# Altium project Phone Charger.PrjPcb
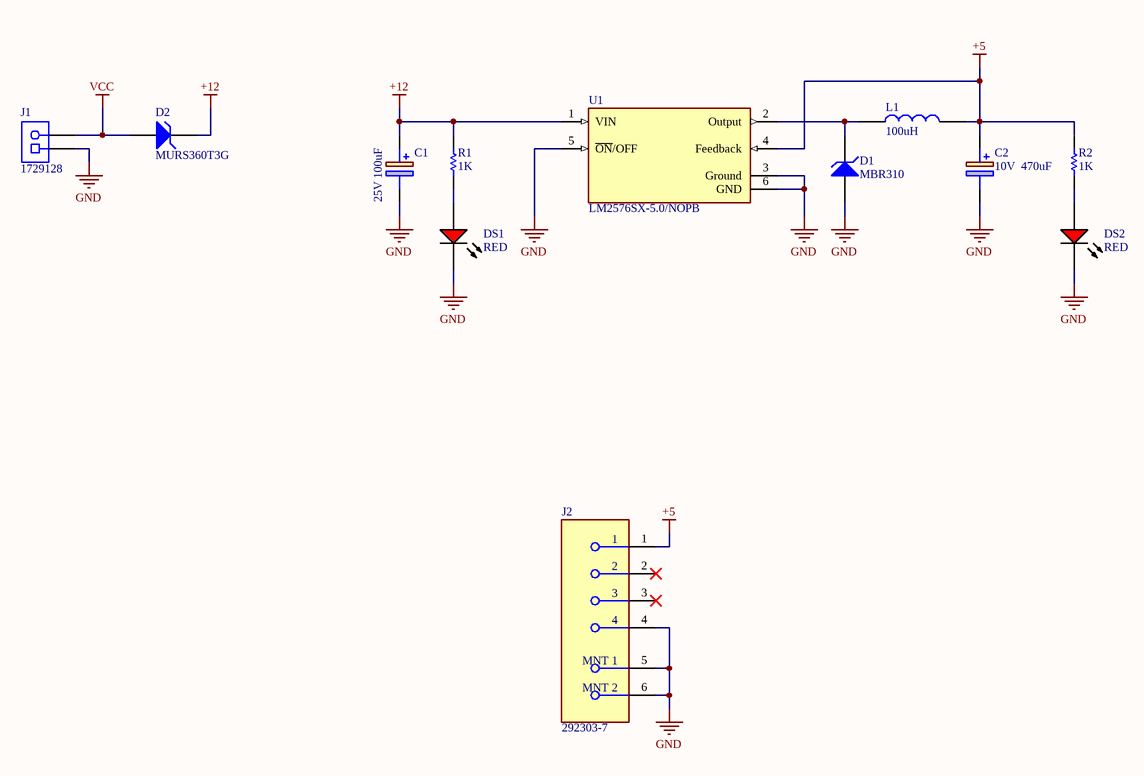
[diagram p0: Sheet1.SchDoc]
1 sheet, 12 parts. Net scope: global (net labels, ports and power ports of the same name join across sheets).
Board file: PCB1.PcbDoc

## Sheet Sheet1.SchDoc
size A4; SheetNumber: 1; SheetTotal: 1

### Parts
C1  25V 100uF  [EEHZA1E101XP]
C2  10V  470uF  [EEHZA1E101XP]
D1  MBR310  [LFUS-DO-214AB-2_V]
D2  MURS360T3G  [LFUS-DO-214AB-2_V]
DS1  RED  [LUMX-SML-LX1206IC_V]
DS2  RED  [LUMX-SML-LX1206IC_V]
J1  1729128  [PHOE-1729128-2_V]
J2  292303-7  [FP-292303-7-MFG]
L1  100uH  [SRR1260101M]
R1  1K  [RESC3216X70X50NL05T20]
R2  1K  [RESC3216X70X50NL05T20]
U1  LM2576SX-5.0/NOPB  [FP-KTT0005B-MFG]

### Nets
+5: C2.1(+) J2.1 L1.2 R2.2 U1.4(Feedback)
+12: C1.1(+) D2.2(K) R1.2 U1.1(VIN)
GND: C1.2(-) C2.2(-) D1.1(A) DS1.2(K) DS2.2(K) J1.1 J2.4 J2.5(MNT_1) J2.6(MNT_2) U1.3(Ground) U1.5(~{ON}/OFF) U1.6(GND)
VCC: D2.1(A) J1.2
NetD1_2: D1.2(K) L1.1 U1.2(Output)
NetDS1_1: DS1.1(A) R1.1
NetDS2_1: DS2.1(A) R2.1

Not connected (* = marked no-connect by the designer): J2 2* 3*

### Library data of the parts
C1 = EEH-ZA1E101XP: BXJ25VC100MF80TP; Manufacturer_Name: Panasonic; Geometry.Height: 8.3mm; Manufacturer_Part_Number: EEH-ZA1E101XP; Mouser Part Number: 667-EEH-ZA1E101XP; Mouser Price/Stock: https://www.mouser.co.uk/ProductDetail/Panasonic/EEH-ZA1E101XP?qs=7UCyOFMWVHbBL6OBgRrCPQ%3D%3D; Arrow Part Number: *; Arrow Price/Stock: *; Datasheet Link: http://industrial.panasonic.com/cdbs/www-data/pdf/RDD0000/ABA0000C1221.pdf
C2 = EEH-ZA1E101XP: EEE-FTA471XAP; Manufacturer_Name: Panasonic; Geometry.Height: 8.3mm; Manufacturer_Part_Number: EEH-ZA1E101XP; Mouser Part Number: 667-EEH-ZA1E101XP; Mouser Price/Stock: https://www.mouser.co.uk/ProductDetail/Panasonic/EEH-ZA1E101XP?qs=7UCyOFMWVHbBL6OBgRrCPQ%3D%3D; Arrow Part Number: *; Arrow Price/Stock: *; Datasheet Link: http://industrial.panasonic.com/cdbs/www-data/pdf/RDD0000/ABA0000C1221.pdf
D1 = CMP-2000-07111-1: MB310_R1_00001; Manufacturer: Littelfuse; Type: Zener; Featured Product: LittelfuseandDigi-KeyofferkitsforpopularTVSSMDdiodes; Power - Peak Pulse: 1500W(1.5kW); Current - Peak Pulse (10/1000µs): 145.7A; Power Line Protection: No; Voltage - Clamping (Max) @ Ipp: 10.3V; Unidirectional Channels: 1; Voltage - Reverse Standoff (Typ): 6V; Catalog Drawings: SMCJDO-214ABSeries; Voltage - Breakdown (Min): 6.67V; Bidirectional Channels: -; Series: SMCJ; Mounting Technology: SurfaceMount; Supplier Device Package: DO-214AB(SMCJ); Packaging: Tape&Reel(TR); Family: TVS-Diodes; Applications: GeneralPurpose; Package Description: 2-Pin Surface Mount Device, Body 6.855 x 5.905 mm; Datasheet Version: 11/2015; Operating Temperature: -55°C~150°C(TJ); Package Reference: DO-214AB; Capacitance @ Frequency: -; Datasheet URL: http://www.littelfuse.com/products/tvs-diodes/surface-mount/~/media/electronics/datasheets/tvs_diodes/littelfuse_tvs_diode_smcj_datasheet.pdf.pdf; Category: CircuitProtection; Package / Case: DO-214AB,SMC; Mounting Type: SurfaceMount; Manufacturer URL: http://www.littelfuse.com/; Standard Package: 3,000
D2 = CMP-2000-07111-1: Manufacturer: Littelfuse; Type: Zener; Featured Product: LittelfuseandDigi-KeyofferkitsforpopularTVSSMDdiodes; Power - Peak Pulse: 1500W(1.5kW); Current - Peak Pulse (10/1000µs): 145.7A; Power Line Protection: No; Voltage - Clamping (Max) @ Ipp: 10.3V; Unidirectional Channels: 1; Voltage - Reverse Standoff (Typ): 6V; Catalog Drawings: SMCJDO-214ABSeries; Voltage - Breakdown (Min): 6.67V; Bidirectional Channels: -; Series: SMCJ; Mounting Technology: SurfaceMount; Supplier Device Package: DO-214AB(SMCJ); Packaging: Tape&Reel(TR); Family: TVS-Diodes; Applications: GeneralPurpose; Package Description: 2-Pin Surface Mount Device, Body 6.855 x 5.905 mm; Datasheet Version: 11/2015; Operating Temperature: -55°C~150°C(TJ); Package Reference: DO-214AB; Capacitance @ Frequency: -; Datasheet URL: http://www.littelfuse.com/products/tvs-diodes/surface-mount/~/media/electronics/datasheets/tvs_diodes/littelfuse_tvs_diode_smcj_datasheet.pdf.pdf; Category: CircuitProtection; Package / Case: DO-214AB,SMC; Mounting Type: SurfaceMount; Manufacturer URL: http://www.littelfuse.com/; Standard Package: 3,000
DS1 DS2 = CMP-2000-07123-1: HL-PC-3216S9AC; Manufacturer: Lumex; Part No: SML-LX1206IC-TR; LED Material: GaAsP; Peak Wavelength: 635nm; Number of LEDs: 1; Viewing Angle: 160; Reverse Voltage: 5(Min)V; Lens Appearance: ColorlessNonDiffused; Intensity: 6mcd; Type: Uni-Color; Pin_Count: 2; Lens Dimensions: 2x1.6x0.5mm; Mounting: SurfaceMount; ECCN: EAR99; RoHS: Unknown; Package Description: 2-Pin Surface Mount Device, Body 3.2 x 1.5 mm; Mounting Technology: SurfaceMount; Dominant Wavelength: N/A; Supplier_Package: SMD; Supplier Standard Pack: 3,000; Color: Red; Dimension: 3.2x1.6x1.1mm; HTS: 8541402000; Family: SML-LX1206IC; Supplier: Lumex; Datasheet URL: http://www.lumex.com/content/files/ProductAttachment/SML-LX1206IC-TR.pdf; Package Reference: SML-LX1206IC; Manufacturer URL: http://www.lumexinstruments.com/; Operating Temperature: -25to85C; Packaging: TapeandReel; Datasheet Version: Rev. J, 08/2012
J1 = CMP-2000-05815-1: PCB Terminal Block, 13.5 A, 400 V, 2-Pin THD, RoHS, Bulk; Manufacturer: Phoenix Contact; Package Version: 03/2015; No. of Rows: 1; Pitch: 5.08mm; No. of Positions: 2; Voltage Rating: 400V; Current Rating: 13500mA; Manufacturer URL: http://www.phoenixcontact.com/; Datasheet URL: https://datasheet.ciiva.com/16046/1729128-16046181.pdf; RoHS: TRUE; Package URL: https://www.phoenixcontact.com/online/portal/pi/pxc/product_detail_page/!ut/p/b1/3VdJjqNKFDxLH8AFycySyWY2ozFsEPOMMQaDOX1XedGL_1Vdm5YXJleknhSKeBkvI6EA8ncAo3AYoDhBQGco6KN7VURTdemj9us_IEKEZo_YHiPAEWEFmDGOHMORkqKYCORBZxgL7ZoaZYcbFFUZ3fqxSY6GOuxydWUuHqz1ynmMFygu583Bob0Ewr6Sd_l-5m-kAueHiB0jpRwZwe58wwtkpxtMYd_LmGcDRU02dRNEyWt6Y2ti5pSyJ_reIkzIulrqApdnbT11V5jnCKbYNCvhEM1MCpPByat_X379-iThf08CI5GfOPqfBeS3BRoBOdD55AKVv0iLwCMq-2BrzXWSGRH7pUGD9uwXQjiph3xL0DKQwdGa0JImiIOmBNOestqgwTHSSs2oOep-78apyXQBvNi8ZLaFjvjWvcaUEBu0MC6Wbe-d6mB0FAebo2lUWinqYaZs5DAYzV0RP9yitUjnGJ0iI9xhZkT42OCQNUJJhkgWINNQLP2JFP6OpMg3JCVg70jqHT0lvKOnhHf0lPuOnnLf0VPuWx6_dxwUIvwk5WMkT0kLL1mh61l2yZVSzG3pYV_bqo-mj6uMKwKwdnnW8Jh5RTOJzMOA5c-eJDaZQw4mTMPH02PvS_ZAqNVjVTo2WyYLkwH_KU1mmmG5kjRhDqPXLwwVHvVOjCM60-fpXvTDfMGW1PVFVS1r4e4yVDk4ZdNbkUHvqPqQSeian4UD39fNKmachqdJ1NJbyk8rXT9mXTvPk3oE5meulKGgiruPJek-4I9hTT6G8ZLOyRSm2RRVbThERQad5OS28hdt4YW4vG0stgYYzsWsK4_7y6DZMjJSCqri1kyiZR5vD7pwIrNR7QwPHTcLTI5qT7eRlpHrdGiupYlqQDJ7zy_CND8fWWBoLRXxk1RVcXiBQwbTD4Xi7KL-FuO94t9xaqweXzH; PartNumber: 1729128; Package Description: 2-Pin Through Hole Device, Body 8.1 x 10.16 mm, Pitch 5.08 mm; Datasheet Version: 12/2013; Mounting Technology: ThroughHole; Orientation: Horizontal; Package Reference: 1729128-2; Packing: Bulk
J2 = CMP-03360-000008-1: CONN RCPT USB2.0 TYPEA 4P SMD RA; Manufacturer: TE Connectivity; Is Female: yes; Current Rating: 1A; Number Of Contacts: 4; Voltage Rating: 30V; Conn Orientation: Right Angle; Shielding: true; Digikey Description: CONN RCPT USB2.0 TYPEA 4P SMD RA; Manufacturer Part Number: 292303-7; Automotive: No; Category: Conn; Temperature: -55°C to +85°C; ComponentLink2Description: Datasheet; Mouser Description: USB Connectors USB A R/A Recpt Assy SMT; Contact Material: Gold,Nickel; Package: 292303-7; Device Class L3: unset; Octopart: https://octopart.com/292303-7-te+connectivity-42840369; RoHS: TRUE; Device Class L2: USB Connectors; ComponentLink2URL: https://www.te.com/usa-en/product-292303-7.html?te_bu=Cor&te_type=other&te_campaign=oct_glo_cor-oct-global-oth-prtnr-fy19-oct-octo-buy-bom_sma-298_2&elqCampaignId=35216; Temperature Range Low: -55°C; Usb Standard: USB 2.0; Temperature Range High: +85°C; Lead Free: Yes; Device Class L1: Connectors
L1 = SRR1260-101M: SRI1209-101M; Manufacturer_Name: Bourns; Geometry.Height: 6.5mm; Manufacturer_Part_Number: SRR1260-101M; Mouser Part Number: 652-SRR1260-101M; Mouser Price/Stock: https://www.mouser.co.uk/ProductDetail/Bourns/SRR1260-101M?qs=uD%2FoUDWqfvQozr%2Ff4%252BPuSQ%3D%3D; Arrow Part Number: SRR1260-101M; Arrow Price/Stock: https://www.arrow.com/en/products/srr1260-101m/bourns?utm_currency=USD&region=nac; Datasheet Link: https://componentsearchengine.com/Datasheets/1/SRR1260-101M.pdf
R1 R2 = CMP-2003-00541-1: 1206S4F1001T5E; Manufacturer: Panasonic; Part Number: ERJ-8GEY0R00V
U1 = CMP-0069-00122-4: IC REG BUCK 5V 3A TO263-5; Efficiency: 77%; Min Input Voltage: 4V; Quiescent Current: 5mA; Synchronous Rectifier: No; Operating Supply Voltage: 40V; Number of Outputs: 1; Switching Frequency: 52kHz; Output Type: Fixed; Max Operating Temperature: 125°C; Radiation Hardening: No; REACH SVHC: No SVHC; Package Quantity: 500; Max Output Current: 3A; Case/Package: TO-263-6; Lead Free: Contains Lead; Contact Plating: Tin; Series: SIMPLE SWITCHER®; Nominal Output Voltage: 5V; Packaging: Tape and Reel; Number of Pins: 5; Max Input Voltage: 40V; Output Voltage: 5V; Min Operating Temperature: -40°C; Output Current: 3A; Mount: Surface Mount